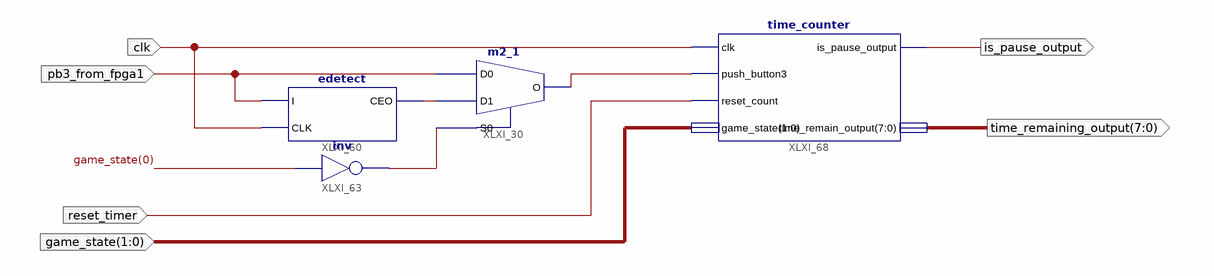
[diagram p0: schematic sheet 1]
// Xilinx ISE schematic fpga2.sch (spartan6) as structural Verilog: 4 symbols, 6 ports
module fpga2 (
  input  [1:0] game_state,
  input  reset_timer,
  input  pb3_from_fpga1,
  input  clk,
  output [7:0] time_remaining_output,
  output is_pause_output
);

  wire XLXN_187, XLXN_188, XLXN_189;

  edetect XLXI_60 (.CEO(XLXN_187), .CLK(clk), .I(pb3_from_fpga1));
  not XLXI_63 (XLXN_189, game_state[0]);
  m2_1 XLXI_30 (.D0(pb3_from_fpga1), .D1(XLXN_187), .S0(XLXN_189), .O(XLXN_188));
  time_counter XLXI_68 (
    .clk(clk), .push_button3(XLXN_188), .reset_count(reset_timer), .game_state(game_state),
    .is_pause_output(is_pause_output), .time_remain_output(time_remaining_output));
endmodule
